# Altium schematic sheet Nucleo.SchDoc
size A4; Organization: BME AUT; Address1: Magyar tudósok krt. 2.; Address2: Q épület; Address3: Budapest; Address4: H-1117; DocumentNumber: 1; SheetNumber: 1; SheetTotal: 2
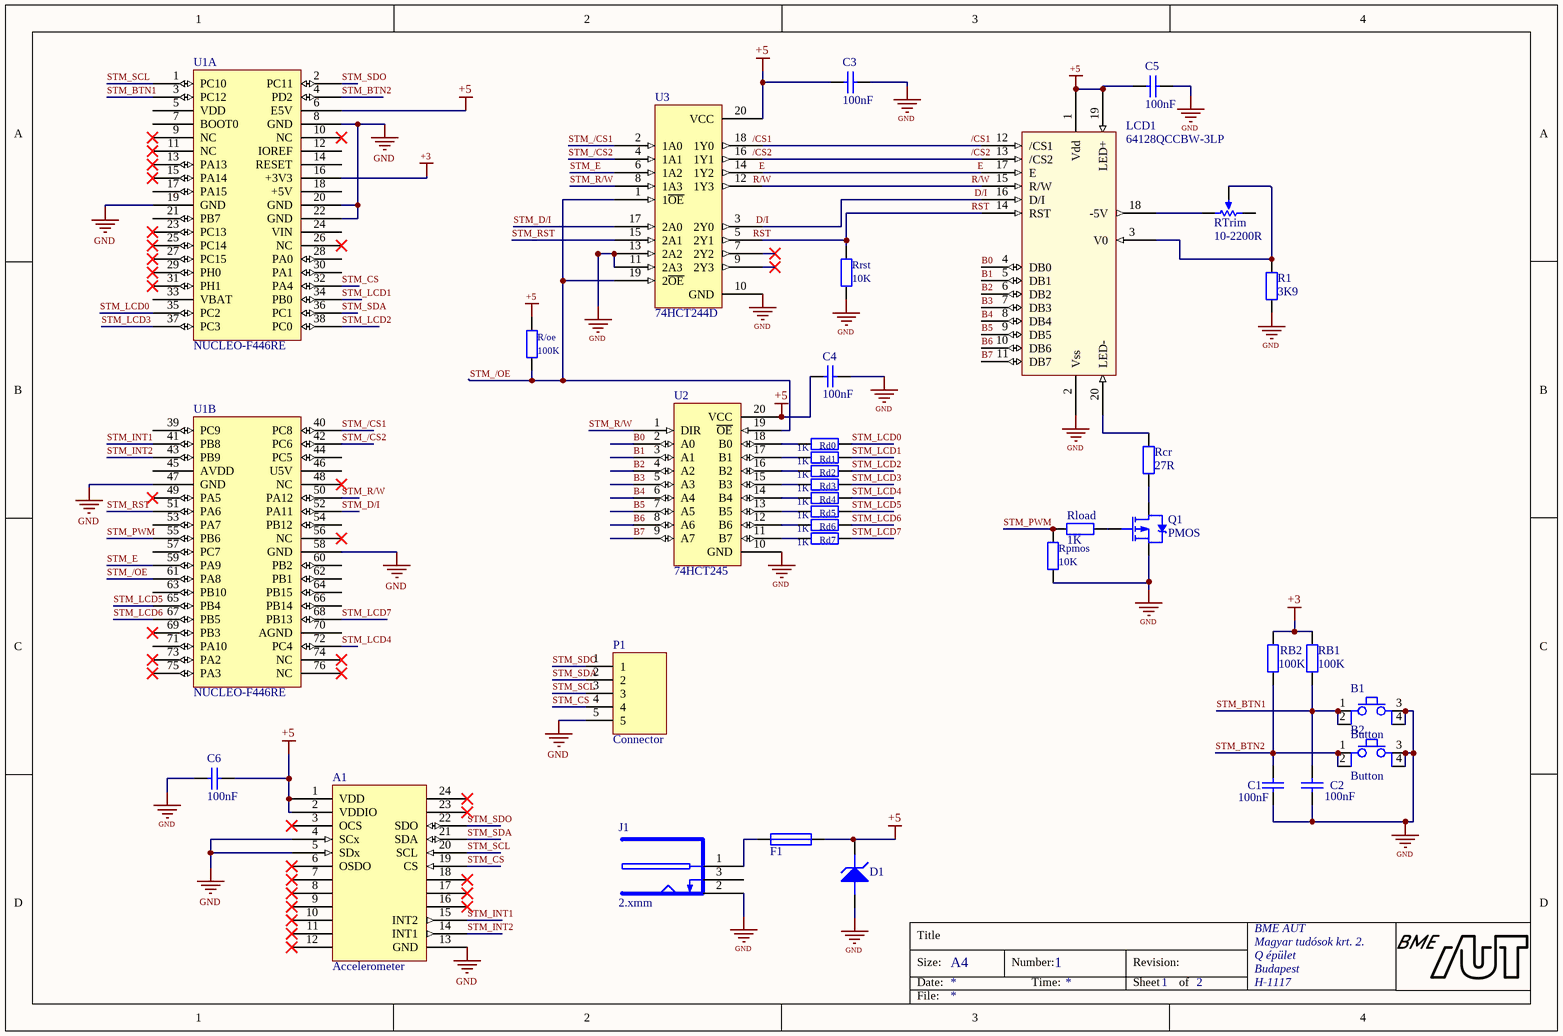
[diagram p0: Nucleo.SchDoc]

## Parts
A1  Accelerometer  [DIL24]
B1  Button  [FP_BTN_SMD]
B2  Button  [FP_BTN_SMD]
C1  100nF  [FP_0805_CAP_085]
C2  100nF  [FP_0805_CAP_085]
C3  100nF  [FP_0805_CAP_085]
C4  100nF  [FP_0805_CAP_085]
C5  100nF  [FP_0805_CAP_085]
C6  100nF  [FP_0805_CAP_085]
D1  TRANS SUPPR  [FP_SMA]  (value not drawn)
F1  Multifuse  [FP_MULTIFUSE]  (value not drawn)
J1  2.xmm  [FP_DC_TAP_ANYA]
LCD1  64128QCCBW-3LP  [64128Q]
P1  Connector  [FP_CONN5_TAP_254MM]
Q1  PMOS  [FP_SOT23-3]
R1  3K9  [FP_0805_RES]
R/oe  100K  [FP_0805_RES]
RB1  100K  [FP_0805_RES]
RB2  100K  [FP_0805_RES]
Rcr  27R  [FP_0805_RES]
Rd0  1K  [FP_0805_RES]
Rd1  1K  [FP_0805_RES]
Rd2  1K  [FP_0805_RES]
Rd3  1K  [FP_0805_RES]
Rd4  1K  [FP_0805_RES]
Rd5  1K  [FP_0805_RES]
Rd6  1K  [FP_0805_RES]
Rd7  1K  [FP_0805_RES]
Rload  1K  [FP_0805_RES]
Rpmos  10K  [FP_0805_RES]
Rrst  10K  [FP_0805_RES]
RTrim  value 10-2200R  [FP_RES_POT]  (hidden comment: RPot)
U1  NUCLEO-F446RE  [FP_NUCLEO-64]  (parts A,B of 2)
U2  74HCT245  [SOP127P1030X265-20M]
U3  74HCT244D  [SOP127P1030X265-20M]

## Nets
+3: RB1.2 RB2.2 U1.16(+3V3)
+5: A1.1(VDD) A1.2(VDDIO) C3.2 C4.2 C5.2 C6.1 D1.1(CATHODE) F1.2 LCD1.1(Vdd) LCD1.19(LED+) R/oe.2 U1.6(E5V) U2.20(VCC) U3.20(VCC)
GND: A1.4(SCx) A1.5(SDx) A1.13(GND) B1.3 B1.4 B2.3 B2.4 C1.1 C2.1 C3.1 C4.1 C5.1 C6.2 D1.2(ANODE) J1.2(SLEEVE) LCD1.2(Vss) P1.5 Q1.3(S) R1.1 Rpmos.1 Rrst.1 U1.8(GND) U1.19(GND) U1.20(GND) U1.22(GND) U1.47(GND) U1.58(GND) U2.10(GND) U3.10(GND) U3.11(2A3) U3.13(2A2)
/CS1: LCD1.12(/CS1) U3.18(1Y0)
/CS2: LCD1.13(/CS2) U3.16(1Y1)
B0: LCD1.4(DB0) U2.2(A0)
B1: LCD1.5(DB1) U2.3(A1)
B2: LCD1.6(DB2) U2.4(A2)
B3: LCD1.7(DB3) U2.5(A3)
B4: LCD1.8(DB4) U2.6(A4)
B5: LCD1.9(DB5) U2.7(A5)
B6: LCD1.10(DB6) U2.8(A6)
B7: LCD1.11(DB7) U2.9(A7)
D/I: LCD1.16(D/I) U3.3(2Y0)
E: LCD1.17(E) U3.14(1Y2)
R/W: LCD1.15(R/W) U3.12(1Y3)
RST: LCD1.14(RST) Rrst.2 U3.5(2Y1)
STM_/CS1: U1.40(PC8) U3.2(1A0)
STM_/CS2: U1.42(PC6) U3.4(1A1)
STM_/OE: R/oe.1 U1.61(PA8) U2.19(~{OE}) U3.1(1~{OE}) U3.19(2~{OE})
STM_BTN1: B1.1 B1.2 C2.2 RB1.1 U1.3(PC12)
STM_BTN2: B2.1 B2.2 C1.2 RB2.1 U1.4(PD2)
STM_CS: A1.19(CS) P1.4 U1.32(PA4)
STM_D/I: U1.52(PA11) U3.17(2A0)
STM_E: U1.59(PA9) U3.6(1A2)
STM_INT1: A1.15(INT2) U1.41(PB8)
STM_INT2: A1.14(INT1) U1.43(PB9)
STM_LCD0: Rd0.2 U1.35(PC2)
STM_LCD1: Rd1.2 U1.34(PB0)
STM_LCD2: Rd2.2 U1.38(PC0)
STM_LCD3: Rd3.2 U1.37(PC3)
STM_LCD4: Rd4.2 U1.72(PC4)
STM_LCD5: Rd5.2 U1.65(PB4)
STM_LCD6: Rd6.2 U1.67(PB5)
STM_LCD7: Rd7.2 U1.68(PB13)
STM_PWM: Rload.1 Rpmos.2 U1.55(PB6)
STM_R/W: U1.50(PA12) U2.1(DIR) U3.8(1A3)
STM_RST: U1.51(PA6) U3.15(2A1)
STM_SCL: A1.20(SCL) P1.3 U1.1(PC10)
STM_SDA: A1.21(SDA) P1.2 U1.36(PC1)
STM_SDO: A1.22(SDO) P1.1 U1.2(PC11)
NetF1_1: F1.1 J1.1(PIN)
NetLCD1_3: LCD1.3(V0) R1.2 RTrim.3(TAP)
NetLCD1_18: LCD1.18(-5V) RTrim.2(BOT)
NetLCD1_20: LCD1.20(LED-) Rcr.2
NetQ1_1: Q1.1(G) Rload.2
NetQ1_2: Q1.2(D) Rcr.1
NetRd0_1: Rd0.1 U2.18(B0)
NetRd1_1: Rd1.1 U2.17(B1)
NetRd2_1: Rd2.1 U2.16(B2)
NetRd3_1: Rd3.1 U2.15(B3)
NetRd4_1: Rd4.1 U2.14(B4)
NetRd5_1: Rd5.1 U2.13(B5)
NetRd6_1: Rd6.1 U2.12(B6)
NetRd7_1: Rd7.1 U2.11(B7)

Not connected (* = marked no-connect by the designer): A1 3(OCS)* 6(OSDO)* 7* 8* 9* 10* 11* 12* 16* 17* 18* 23* 24*; J1 3(BREAK); RTrim 1(TOP); U1 5(VDD) 7(BOOT0) 9(NC)* 10(NC)* 11(NC)* 12(IOREF) 13(PA13)* 14(RESET) 15(PA14)* 17(PA15) 18(+5V) 21(PB7) 23(PC13)* 24(VIN) 25(PC14)* 26(NC)* 27(PC15)* 28(PA0) 29(PH0)* 30(PA1) 31(PH1)* 33(VBAT) 39(PC9) 44(PC5) 45(AVDD) 46(U5V) 48(NC)* 49(PA5)* 53(PA7) 54(PB12) 56(NC)* 57(PC7) 60(PB2) 62(PB1) 63(PB10) 64(PB15) 66(PB14) 69(PB3)* 70(AGND) 71(PA10) 73(PA2)* 74(NC)* 75(PA3)* 76(NC)*; U3 7(2Y2)* 9(2Y3)*

## Notes on the sheet
- Title
- Size:
- Date:
- A4
- Number:
- Time:
- Revision:
- Sheet
- of
- File:

## Library data of the parts
A1 = STEVAL-MKI160V1: Name: Accelerometer; Supplier: ST tanszek
B1 B2 = Button: Push button; Name: TACT 6x 6 4P SPST 1 FSM2JSMA (TYC) 50mA 12VDC SMD H=4.3mm 160g BLACK B. 2-1437565-7; Reference: 45-05-42; Supplier: Lomex
C1-C6 = CAP 100nF: Capacitor; Tolerance: 10%; Voltage: 50V; Name: 100nF 0805 10% 50V X7R 0805B104K500CT (WAL); Supplier: Lomex; Reference: 82-10-76; Value: 100nF
D1 = TRANS SUPPR: Transient suppressor; pin to pad: 1>2 2>1; Name: 6.7V Ubr 400W UNIDIR. 5V Urwm SMAJ5.0A (LFS) DO-214AC (SMA) ˝AE˝; Voltage: 6.7V; Supplier: Lomex; Reference: 96-00-75
F1 = Multifuse: 1812 Multifuse; Name: 1.1A 16V 1812L110/16DR POLYFUSE SMD 1812 (LFS) ˝LF110-16˝; Reference: 44-02-36; Supplier: Lomex
J1 = DC_TAP_ANYA: 2.xmm DC HEBA25 TÁPFESZÜLTSÉG ALJZAT ZÁRT, NYÁKBA 90°; Name: TÁP DC ANYA 5.5/2.1/9.5mm DCS-5521-5; Supplier: Lomex; Reference: 43-07-67
LCD1 = 64128QCCBW-3LP: Led Display Module; Name: 128x 64 DOT LIGHT:LED 64128QCCBW-3LP (DIS) 0.4/DOT 75x53mm BLUE STN LOW.POW. WIDE TEMP. (CONTROLLER/DRIVER: SBN6400G-D + SBN0064G-D); Reference: 37-00-71; Supplier: Lomex
P1 = Connector_5pin: 5pin Connector
Q1 = PMOS: MOSFET, P CH; pin to pad: 2>3 3>2; Name: BSS84 (FAI) P-FET 50V 0.13A Rds<10R SOT-23 ˝13*˝; Supplier: Lomex; Reference: 86-03-27
R1 = RES 3K9: Resistor; Tolerance: 5%; Power: 125mW; Name: 3K90 0805 5% CR-05JL7---3K9 0.125W (VIK); Supplier: Lomex; Reference: 81-10-94; Value: 3K9
R/oe RB1 RB2 = RES 100K: Resistor; Tolerance: 5%; Power: 125mW; Name: 100K 0805 5% CR-05JL7--100K 0.125W (VIK); Supplier: Lomex; Reference: 81-11-11; Value: 100K
Rcr = RES 27R: Resistor; Tolerance: 5%; Power: 125mW; Name: 27R0 0805 5% CR-05JL7---27R 0.125W (VIK); Supplier: Lomex; Reference: 81-10-68; Value: 27R
Rd0-Rd7 Rload = RES 1K: Resistor; Tolerance: 5%; Power: 125mW; Name: 1K00 0805 5% CR-05JL7----1K 0.125W (VIK); Supplier: Lomex; Reference: 81-10-87; Value: 1K
Rpmos Rrst = RES 10K: Resistor; Tolerance: 5%; Power: 125mW; Name: 10K0 0805 5% CR-05JL7---10K 0.125W (VIK); Supplier: Lomex; Reference: 81-10-99; Value: 10K
RTrim = RPot: Potentiometer; 5: Enter the Resistance value and the set point into parameter fields.; Name: 2K20 PT10LV10 (KEN) D=10 TOP ADJ. 5x10; Supplier: Lomex; Reference: 05-07-17
U1 = NUCLEO-F446RE: Reference: NUCLEO; Name: Nucleo F446RE; Supplier: Tanszék
U2 = 74HCT245: 8x Bidirectional bus transciever; Name: 74HCT245D  Transceiver, 74HCT245; Supplier: Lomex; Reference: 87-06-35
U3 = 74HCT244D: 8xBuffer/Line Driver; Name: 74HCT244D-Q100,118  Buffer / Line Driver, 74HCT244; Reference: 87-05-95; Supplier: Lomex